# EAGLE design rw-linear-17mm-mk-1.0 (EAGLE 7.5.0)
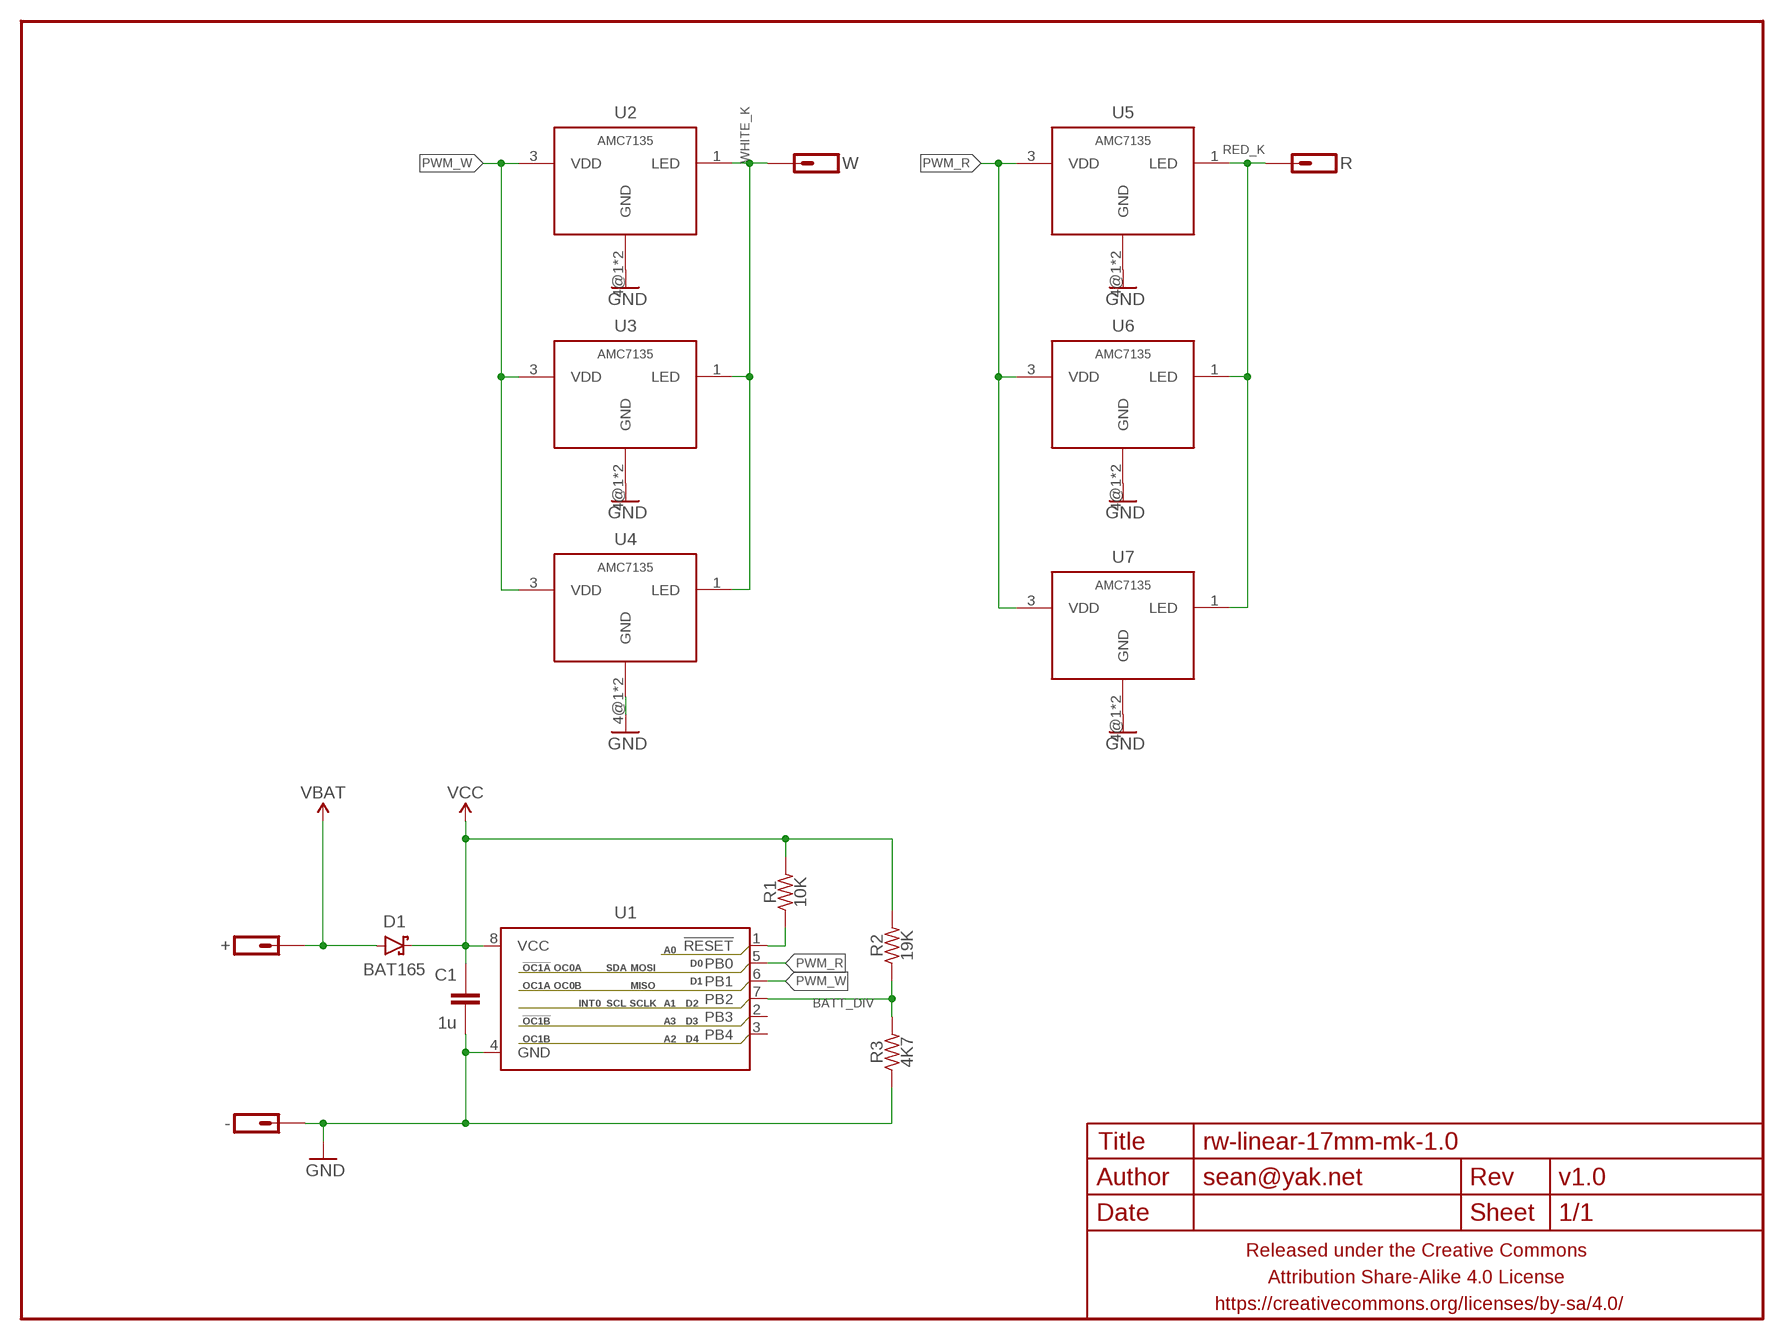
[diagram p0: schematic, sheet 1]

## Parts
+  M01PTH-1.2MM-NS  [1X01-1.2MM-NS]
-  M01NOT-A-VIA-NOPE  [1X01_NOSILK_NOSTOP]
C1  1u  CAPACITOR-CERAMICC0402  [C0402]
D1  BAT165  DIODE-SCHOTTKYSOD323  [SOD323-SCHOTTKY]
FRAME1  FRAME-LETTERNO_PACKAGE  [DUMMY]
R  M01SMD-1.25MM-DIA  [1X01-SMD-1.25MM-DIA-NS]
R1  10K  RESISTORR0402  [R0402]
R2  19K  RESISTORR0402  [R0402]
R3  4K7  RESISTORR0402  [R0402]
U1  ATTINY13SOIC-NARROWPADS  [SO08-NARROWER]
U2  AMC7135  AMC7135SOT-89-NOTHERM  [SOT89-NOTHERM]
U3  AMC7135  AMC7135SOT-89-NOTHERM  [SOT89-NOTHERM]
U4  AMC7135  AMC7135SOT-89-NOTHERM  [SOT89-NOTHERM]
U5  AMC7135  AMC7135SOT-89-NOTHERM  [SOT89-NOTHERM]
U6  AMC7135  AMC7135SOT-89-NOTHERM  [SOT89-NOTHERM]
U7  AMC7135  AMC7135SOT-89-NOTHERM  [SOT89-NOTHERM]
W  M01SMD-1.25MM-DIA  [1X01-SMD-1.25MM-DIA-NS]

## Nets
BATT_DIV: R2.1 R3.2 U1.7(PB2)
GND: -.P$1 C1.2 R3.1 U1.4(GND) U2.4@1(GND) U2.4@2(GND) U3.4@1(GND) U3.4@2(GND) U4.4@1(GND) U4.4@2(GND) U5.4@1(GND) U5.4@2(GND) U6.4@1(GND) U6.4@2(GND) U7.4@1(GND) U7.4@2(GND)
N$4: R1.1 U1.1(!RESET)
PWM_R: U1.5(PB0) U5.3(VDD) U6.3(VDD) U7.3(VDD)
PWM_W: U1.6(PB1) U2.3(VDD) U3.3(VDD) U4.3(VDD)
RED_K: R.P$1 U5.1(LED) U6.1(LED) U7.1(LED)
VBAT: +.P$1 D1.A
VCC: C1.1 D1.C R1.2 R2.2 U1.8(VCC)
WHITE_K: U2.1(LED) U3.1(LED) U4.1(LED) W.P$1
Unconnected: U1.2(PB3) U1.3(PB4)

## Library data of the parts
+ - R W = a_parts:M01: Header 1 Standard 1-pin 0.1" header. Use with straight break away headers (SKU : PRT-00116), right angle break away headers (PRT-00553), swiss pins (PRT-00743), machine pins (PRT-00117), and female headers (PRT-00115).
C1 = a_parts:CAPACITOR-CERAMIC: CAPACITOR, European symbol
D1 = a_parts:DIODE-SCHOTTKY: Schottky diodes in SFE's production catalog BAT20J 1A 23V 0.62Vf RB751 120mA 40V 0.37Vf PMEG4005EJ 0.5A 40V 0.42Vf MBRA140 1A 40V 0.5Vf B340A 3A 40V SMA
FRAME1 = a_parts:FRAME-LETTER: Schematic Frame Standard 8.5x11 US Letter frame; DESIGNER: sean@yak.net; VERSION: v1.0
R1-R3 = a_parts:RESISTOR: RESISTOR, American symbol
U1 = a_parts:ATTINY13: Atmel 8-pin 1kB flash uC
U2-U7 = a_parts:AMC7135

## Board
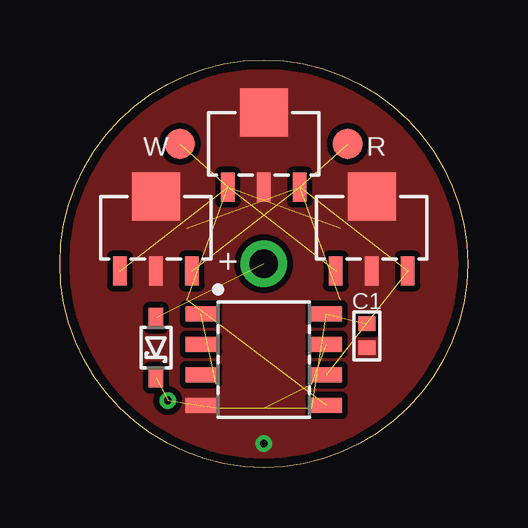
[diagram p1: board, top side]
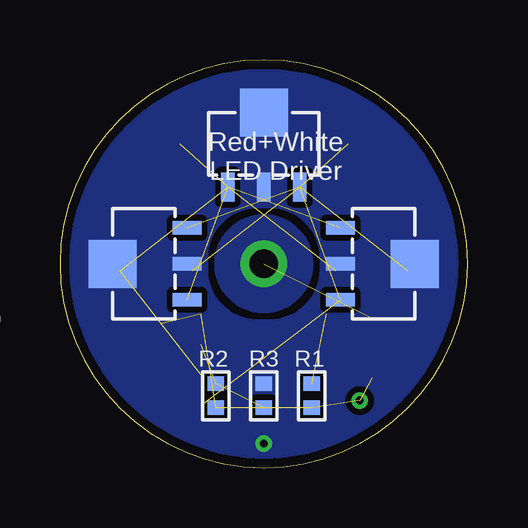
[diagram p2: board, bottom side, seen from below]

Size 17 x 17 mm. Coordinates in mm from the lower left corner, seen from the top.
Outline: 0,8.5 arc-180 17,8.5 arc-180 0,8.5
Copper layers (1*16): Top 0.0356mm / dielectric 1.5011mm / Bottom 0.0356mm
Design rules "LaenPCBOrder2": minimum track width 6mil, minimum drill 13mil, track to track 6mil, track to pad 6mil, pad to pad 6mil, via to via 6mil, smd to smd 6mil, copper to edge 15mil, drill to drill 6mil, minimum pad ring 7mil, minimum via ring 7mil, stop-mask expansion 3mil, vias tented up to drill 20mil, thermal gap 10mil

### Footprints (pad centres in the part's own frame; a part is rotated, then mirrored left to right if it is on the bottom)
1X01-1.2MM-NS = drill 1.2 pad 1.93: P$1 0,0
1X01_NOSILK_NOSTOP = drill 0.33: P$1 0,0
C0402 = smd 0.6 x 0.7: 1 -0.5,0; 2 0.5,0
SOD323-SCHOTTKY = smd 0.8 x 0.6: A -1.25,0; C 1.25,0
1X01-SMD-1.25MM-DIA-NS = smd 1.25 x 1.25: P$1 0,0
R0402 = smd 0.6 x 0.7: 1 -0.5,0; 2 0.5,0
SO08-NARROWER = smd 0.635 x 1.27: 1 -1.905,-2.616; 2 -0.635,-2.616; 3 0.635,-2.616; 4 1.905,-2.616; 5 1.905,2.616; 6 0.635,2.616; 7 -0.635,2.616; 8 -1.905,2.616
SOT89-NOTHERM = smd 0.58 x 1.2: 1 -1.5,-1.8; 3 1.5,-1.8; 4@1 0,-1.8 | smd 2 x 2: 4@2 0,1.3

### Placement (x,y rotation side)
+  8.5,8.5 90 top
-  8.5,1 90 bottom
C1  12.8,5.5 270 top
D1  4,5 270 top
FRAME1  0,0 0 top
R  12,13.5 0 top
R1  6.5,3 270 bottom
R2  10.5,3 270 bottom
R3  8.5,3 270 bottom
U1  8.5,4.5 270 top
U2  4,10 0 top
U3  8.5,13.5 0 top
U4  13,10 0 top
U5  8.5,13.5 0 bottom
U6  3.5,8.5 270 bottom
U7  13.5,8.5 90 bottom
W  5,13.5 270 top

### Tracks (layer width: path | path; a pad name or v marks a point on that pad's centre or on a via)
BATT_DIV  (2 unrouted)
GND
  pour Top (isolate 0.25, rank 6, no thermals): 0,0 17,0 17,17 0,17
  pour Bottom (isolate 0.25, rank 6, no thermals): 0,0 0,17 17,17 17,0
N$4  (1 unrouted)
PWM_R  (3 unrouted)
PWM_W  (3 unrouted)
RED_K  (3 unrouted)
VBAT  (1 unrouted)
  pour Bottom (isolate 0.152, no thermals): 6.5,8.5 arc-180 10.5,8.5 arc-180
VCC  (via drill 0.33)  (5 unrouted)
  other vias: 4.5,2.8
WHITE_K  (3 unrouted)

### Text on the board
bPlace: Red+White / LED Driver